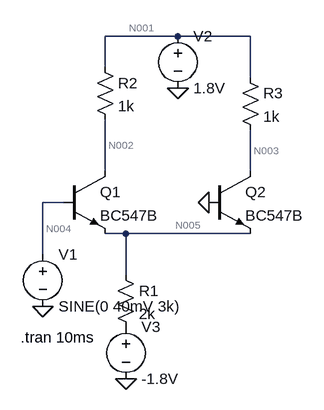
[diagram p0: schematic initial-1-0-1.asc]
initial-1-0-1.asc, the LTspice schematic file:
Version 4
SHEET 1 880 680
WIRE 272 -240 160 -240
WIRE 384 -240 272 -240
WIRE 160 -192 160 -240
WIRE 384 -176 384 -240
WIRE 160 -32 160 -112
WIRE 384 -32 384 -96
WIRE 96 16 64 16
WIRE 192 64 160 64
WIRE 384 64 192 64
WIRE 64 96 64 16
WIRE 192 128 192 64
FLAG 64 176 0
FLAG 320 16 0
FLAG 272 -160 0
FLAG 192 288 0
SYMBOL res 176 112 R0
SYMATTR InstName R1
SYMATTR Value 2k
SYMBOL voltage 64 80 R0
WINDOW 123 0 0 Left 0
WINDOW 39 0 0 Left 0
SYMATTR InstName V1
SYMATTR Value SINE(0 40mV 3k)
SYMBOL npn 96 -32 R0
SYMATTR InstName Q1
SYMATTR Value BC547B
SYMBOL npn 320 -32 R0
SYMATTR InstName Q2
SYMATTR Value BC547B
SYMBOL res 144 -208 R0
SYMATTR InstName R2
SYMATTR Value 1k
SYMBOL res 368 -192 R0
SYMATTR InstName R3
SYMATTR Value 1k
SYMBOL voltage 272 -256 R0
WINDOW 123 0 0 Left 0
WINDOW 39 0 0 Left 0
SYMATTR InstName V2
SYMATTR Value 1.8V
SYMBOL voltage 192 192 R0
WINDOW 123 0 0 Left 0
WINDOW 39 0 0 Left 0
SYMATTR InstName V3
SYMATTR Value -1.8V
TEXT 30 224 Left 2 !.tran 10ms

The netlist it stands for:
* initial-1-0-1.asc
R1 N005 P001 2k
V1 N004 0 SINE(0 40mV 3k)
Q1 N002 N004 N005 0 BC547B
Q2 N003 0 N005 0 BC547B
R2 N001 N002 1k
R3 N001 N003 1k
V2 N001 0 1.8V
V3 P001 0 -1.8V
.model NPN NPN
.model PNP PNP
.lib standard.bjt
.tran 10ms
.backanno
.end

* Results of the author's LTspice run, read from the files saved beside the schematic
* Operating Point, zero values left out:
*   V(n005) = -606.2 mV
*   V(p001) = -1.8 V
*   V(n002) = 1.503 V
*   V(n003) = 1.503 V
*   V(n001) = 1.8 V
*   Ic(Q2) = 297.4 µA
*   Ib(Q2) = 1.027 µA
*   Ie(Q2) = -298.4 µA
*   Ic(Q1) = 297.4 µA
*   Ib(Q1) = 1.027 µA
*   Ie(Q1) = -298.4 µA
*   I(R3) = 297.4 µA
*   I(R2) = 297.4 µA
*   I(R1) = 596.9 µA
*   I(V3) = 596.9 µA
*   I(V2) = -594.8 µA
*   I(V1) = -1.027 µA
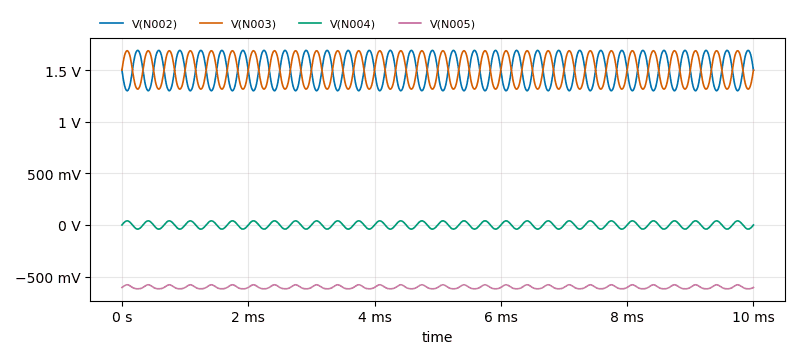
[diagram p1: Transient Analysis of initial-1-0-1.asc, plotted from the saved traces]
* Transient Analysis, 1 run:
*   V(N002): min 1.302 V, max 1.694 V, average 1.5 V, rms 1.507 V, last 1.503 V
*   V(N003): min 1.318 V, max 1.69 V, average 1.503 V, rms 1.51 V, last 1.503 V
*   V(N004): min -40 mV, max 40 mV, average 4.894 nV, rms 28.3 mV, last 0 V
*   V(N005): min -619 mV, max -580 mV, average -602.8 mV, rms 602.9 mV, last -606.2 mV